# Altium schematic sheet Sheet2.SchDoc
size A; SheetNumber: 2; SheetTotal: 2
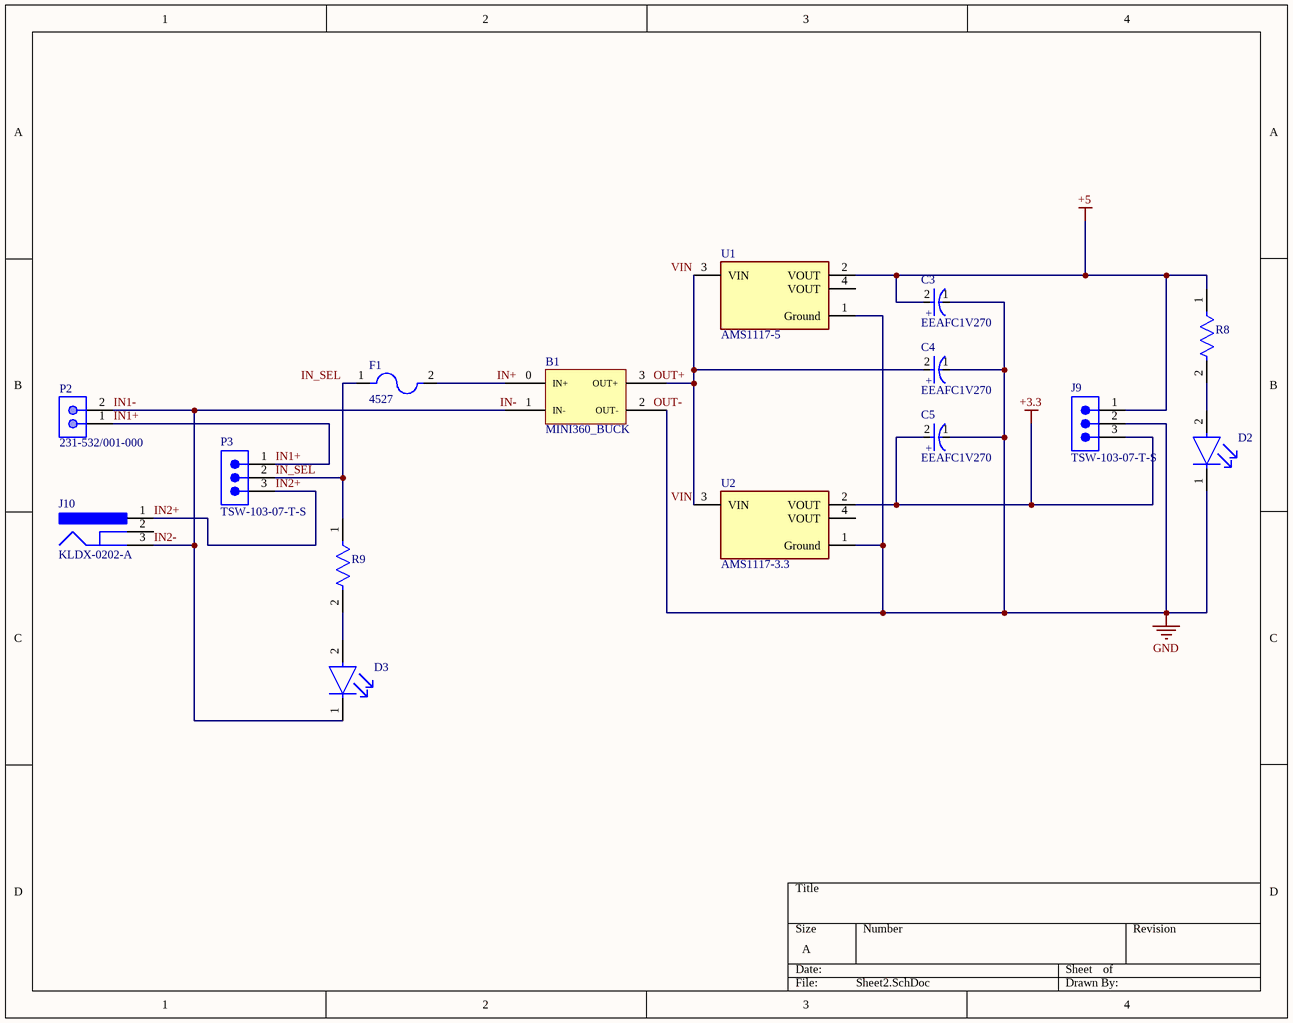
[diagram p0: Sheet2.SchDoc]

## Parts
B1  MINI360_BUCK  [MINI360_BUCK]
C3  EEAFC1V270  [FP-RAD-TH-D_6_3_0_5-L_7_1-MFG]
C4  EEAFC1V270  [FP-RAD-TH-D_6_3_0_5-L_7_1-MFG]
C5  EEAFC1V270  [FP-RAD-TH-D_6_3_0_5-L_7_1-MFG]
D2  SSL-LX5093YD  [FP-SSL-LX5093YD-MFG]  (value not drawn)
D3  SSL-LX5093YD  [FP-SSL-LX5093YD-MFG]  (value not drawn)
F1  4527  [FUSE_4527]
J9  TSW-103-07-T-S  [SMTC-TSW-103-07-X-S]
J10  KLDX-0202-A  [KYCN-KLDX-0202-A_V]
P2  231-532/001-000  [WAGO-231-532-001-000_V]
P3  TSW-103-07-T-S  [SMTC-TSW-103-07-X-S]
R8  VR37000001204JA100  [FP-VR37-MFG]  (value not drawn)
R9  VR37000001204JA100  [FP-VR37-MFG]  (value not drawn)
U1  AMS1117-5  [FP-AMS1117-IPC_C]
U2  AMS1117-3.3  [FP-AMS1117-IPC_C]

## Nets
+3.3: C5.2(A) J9.3 U2.2(VOUT)
+5: C3.2(A) J9.1 R8.1 U1.2(VOUT)
GND: B1.2(OUT-) C3.1(C) C4.1(C) C5.1(C) D2.1(C) J9.2 U1.1(Ground) U2.1(Ground)
IN1+: P2.1 P3.1
IN1-: B1.1(IN-) D3.1(C) J10.3 P2.2  [also labelled IN2-]
IN2+: J10.1 P3.3
IN_SEL: F1.1 P3.2 R9.1
VIN: B1.3(OUT+) C4.2(A) U1.3(VIN) U2.3(VIN)
NetB1_0: B1.0(IN+) F1.2
NetD2_2: D2.2(A) R8.2
NetD3_2: D3.2(A) R9.2

Not connected (* = marked no-connect by the designer): J10 2; U1 4(VOUT); U2 4(VOUT)

## Notes on the sheet
- Labels drawn without touching a wire or pin: IN+, IN-, OUT+, OUT-
- (in symbol CMP-05427-002000-1) +

## Library data of the parts
C3-C5 = CMP-05427-002000-1: Aluminum Electrolytic Capacitors (Radial Lead Type) AEC-Q200 Qualified 27uF ±20% 35V; Leakage Current: 3uA; Life (Hours): 1000Hour; Ripple Current: 200mA; ESR (Equivalent Series Resistance): 450mR; Lead Diameter: 0.45mm; Case/Package: Radial; Tolerance: 20%; Voltage Rating: 35V; Lead Pitch: 2.5mm; Max Operating Temperature: 105°C; Packaging: Bulk; RoHS Compliant: Yes; Voltage: 35V; Construction: RADIAL; Diameter: 6.3mm; Termination: Radial; Mount: Through Hole; Package Quantity: 200; Min Operating Temperature: -55°C; Voltage Rating (DC): 35V; Height: 7mm; Series: FC; Radiation Hardening: No; Capacitance: 27uF; Length: 7mm
D2 D3 = CMP-57192-000007-1: LED YELLOW DIFFUSED T-1 3/4 T/H; Test Current: 20mA; Number of LEDs: 1; Dominant Wavelength: 568nm; Wavelength: 585nm; Forward Voltage: 2.1V; Lens Style: Dome; Viewing Angle: 60°; Luminous Intensity: 30mcd; Min Operating Temperature: -40°C; Packaging: Bulk; Width: 1.5inch; Lead Free: Lead Free; Number of Pins: 2; Color: Yellow; Case/Package: Radial; Forward Current: 20mA; REACH SVHC: No SVHC; Lens Transparency: Diffused; Weight: 0.01lb; Height: 8.6mm; Package Quantity: 1000; Series: -; Length: 0.5inch; Illumination Color: Yellow; Mount: Through Hole; Diameter: 5mm; RoHS Compliant: Yes; Lens Color: Yellow; Max Operating Temperature: 85°C
F1 = 4527: 5mm Low Profile Holder; MF: Keystone; MP: 4527; Price: None; Purchase-URL: https://pricing.snapeda.com/search/part/4527/?ref=eda; Package: None; Availability: In Stock; SnapEDA_Link: https://www.snapeda.com/parts/4527/Keystone+Electronics/view-part/?ref=snap; Value: *; Check_prices: https://www.snapeda.com/parts/4527/Keystone+Electronics/view-part/?ref=eda
J9 P3 = CMP-1024-00332-1: 0.025" SQ Post Header, Through-hole, Vertical, -55 to 105 degC, 2.54 mm Pitch, 3-Pin, Male, RoHS; Manufacturer: Samtec; Pitch: 2.54 mm; ComponentLink1URL: http://www.samtec.com; ComponentLink3URL: http://www.samtec.com/documents/webfiles/cpdf/TSW-XXX-XX-XXX-X-XX-XXX-MKT.pdf; PartNumber: TSW-103-07-T-S; Mounting Technology: Through-hole; RoHS: True; DatasheetVersion: F-214; PackageVersion: DM, 8/1988; Temperature Range: -55 to 105 degC; ComponentLink2Description: Datasheet; ComponentLink1Description: Manufacturer URL; Orientation: Vertical; PackageReference: TSW-103-07-X-S; ComponentLink3Description: Package Specification; ComponentLink2URL: http://www.samtec.com/documents/webfiles/pdf/TSW_TH.PDF; PackageDescription: .025[0.64] SQ. Post Terminal Strip Assembly
J10 = CMP-1673-00001-5: DC Power Jack, 24 V, 3.5 A, -25 to 85 degC, 3-Pin THD, RoHS; Manufacturer: Kycon; Voltage Rating: 24 V; Current Rating: 3.5 A; Height: 10.8 mm; Length: 9.2 mm; Pins: 2; Housing Material: PBT; Connector Type: Power; ComponentLink2URL: http://www.kycon.com/Pub_Eng_Draw/KLDX-0202-X.PDF; PackageDescription: 3-Pin Through Hole Device, Body 14.5 x 9 mm; Max Operating Temperature: 85 degC; Min Operating Temperature: -25 degC; PackageReference: KLDX-0202-A; Contact Gender: Female; Package Quantity: 500; Mount: Through Hole; Colour: Black; Contact Plating: Tin; DatasheetVersion: Rev. D3, 06/2013; ComponentLink2Description: Datasheet; RoHSCompliant: true; Mounting Technology: Through Hole; ComponentLink1Description: Manufacturer URL; Contact Material: Brass; ComponentLink1URL: http://www.kycon.com/
P2 = CMP-2000-05540-1: Male Connector, Right Angle, Pitch 5.08 mm, 1 x 2 Posistion, Height 8.4 mm, -60 to 100 degC, RoHS; Manufacturer: WAGO; Max. temperature: +100°C; Contact surface: Tinplated; Content: 200pc(s); Total number of pins: 2; Connectors: wire-to-board; Nominal voltage: 320V; T: 12mm; Pitch: 5.08mm; Min. temperature: -60°C; Industrial packaging: Yes; Connector type: Plug,rightangle; Connection: Print; Nominal current: 12A; Case material: Polyamide6.6; Connector orientation: Parallel(tothePCB); Manufacturer URL: http://global.wago.com/en/index-en.jsp; Insulation material: Polyamide6.6; Height: 12.2mm; Contact material: Cathodecopper; Datasheet URL: http://www.farnell.com/datasheets/2079603.pdf; Colour: Orange; Category: Pinstrip(standard); CS: 5.08mm; Package Description: Male Connector, Right Angle, Pitch 5.08 mm, 1 x 2 Posistion, Height 8.4 mm; Type: CLOSEDENDMaleConnector1X1HOR.5,; Mounting Technology: ThroughHole; Manufacturer part No.: 231-532/001-000; Package Reference: 231-532-001-000; Length: 12mm; Width: 13.36mm; Datasheet Version: 01/2016; Series: 231; Pins per row: 2
R8 R9 = CMP-02408-000054-1: RES 1.2M OHM 5% 1/2W AXIAL; Voltage Rating: 3.5kV; Power Rating: 500mW; Temperature Coefficient: 200ppm/°C; Resistance: 1.2MR; Diameter: 4mm; Max Operating Temperature: 155°C; Military Standard: Not; Reach SVHC Compliant: Yes; Min Operating Temperature: -55°C; Resistance Tolerance: 5%; Resistor Type: Metal Film; Tolerance: 5%; Mount: Through Hole; Construction: Cylindrical; Contact Plating: Tin; Length: 10mm; Termination: Axial; Voltage Rating (DC): 3.5kV; Packaging: Ammo Pack; Radiation Hardening: No; Case/Package: Conformal
U1 = CMP-209535-000001-1: LDO Voltage Regulators 1A, 3.3V; Manufacturer Part Number: AMS1117-3.3; Manufacturer: Advanced Monolithic Systems; Dropout Voltage: 1.1V; Output Type: Fixed; Nominal Supply Current: 5mA; Max Power Dissipation: 1.2W; Max Supply Voltage: 15V; Number Of Outputs: 1; Standoff Height: 0.64mm; Max Junction Temp: +125°C; Height: 1.8mm; Package: AMS1117; Device Class L2: Power Management ICs; ComponentLink2Description: Datasheet; ComponentLink2URL: http://www.advanced-monolithic.com/pdf/ds1117.pdf; Category: IC; RoHS: TRUE; Automotive: No; Device Class L1: Integrated Circuits (ICs); Output Current: 1A; Device Class L3: Voltage Regulators - Linear; Temperature: -40°C to +125°C; Output Voltage: 3.3V; Temperature Range Low: -40°C; Octopart: https://octopart.com/ams1117-3.3-advanced+monolithic+systems-25899300; Lead Free: Yes; Ipc Land Pattern Name: SOT229P700X180-4; Temperature Range High: +125°C
U2 = CMP-209535-000001-1: LDO Voltage Regulators 1A, 3.3V; Manufacturer: Advanced Monolithic Systems; Dropout Voltage: 1.1V; Output Type: Fixed; Nominal Supply Current: 5mA; Max Power Dissipation: 1.2W; Max Supply Voltage: 15V; Number Of Outputs: 1; Standoff Height: 0.64mm; Max Junction Temp: +125°C; Height: 1.8mm; Package: AMS1117; Device Class L2: Power Management ICs; ComponentLink2Description: Datasheet; ComponentLink2URL: http://www.advanced-monolithic.com/pdf/ds1117.pdf; Category: IC; RoHS: TRUE; Automotive: No; Device Class L1: Integrated Circuits (ICs); Output Current: 1A; Device Class L3: Voltage Regulators - Linear; Temperature: -40°C to +125°C; Output Voltage: 3.3V; Manufacturer Part Number: AMS1117-3.3; Temperature Range Low: -40°C; Octopart: https://octopart.com/ams1117-3.3-advanced+monolithic+systems-25899300; Lead Free: Yes; Ipc Land Pattern Name: SOT229P700X180-4; Temperature Range High: +125°C